# Altium project PCB_Project.PrjPcb
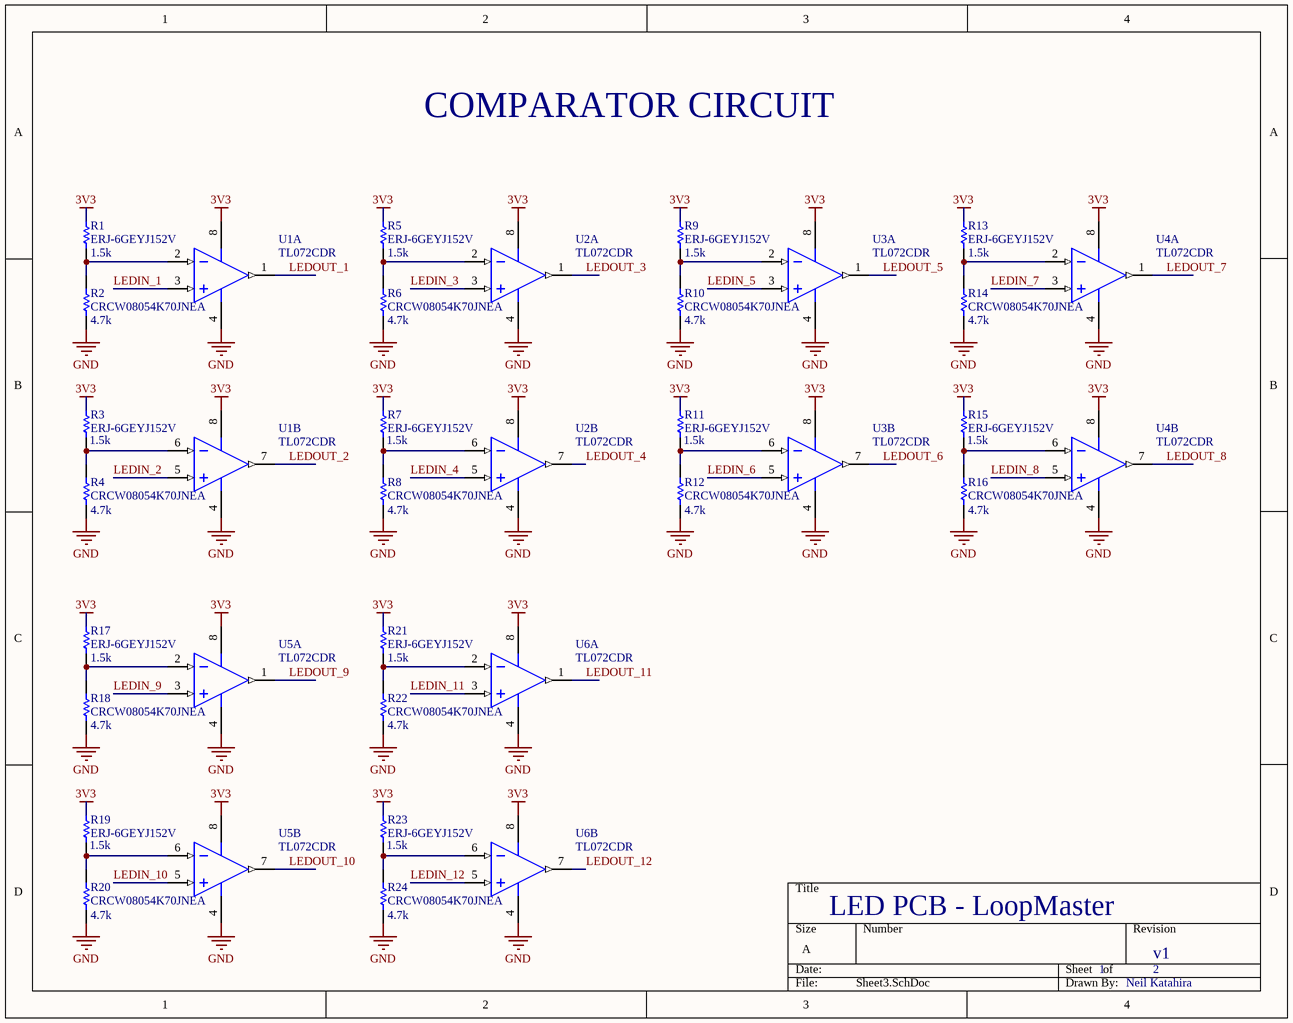
[diagram p0: Sheet3.SchDoc]
1 sheet, 30 parts. Net scope: global (net labels, ports and power ports of the same name join across sheets).
Board file: PCB2.PcbDoc

## Sheet Sheet3.SchDoc
size A

### Parts
R1  ERJ-6GEYJ152V  [RESC2013X70X40NL20T20]
R2  CRCW08054K70JNEA  [RESC2013X50X30LL20T20]
R3  ERJ-6GEYJ152V  [RESC2013X70X40NL20T20]
R4  CRCW08054K70JNEA  [RESC2013X50X30LL20T20]
R5  ERJ-6GEYJ152V  [RESC2013X70X40NL20T20]
R6  CRCW08054K70JNEA  [RESC2013X50X30LL20T20]
R7  ERJ-6GEYJ152V  [RESC2013X70X40NL20T20]
R8  CRCW08054K70JNEA  [RESC2013X50X30LL20T20]
R9  ERJ-6GEYJ152V  [RESC2013X70X40NL20T20]
R10  CRCW08054K70JNEA  [RESC2013X50X30LL20T20]
R11  ERJ-6GEYJ152V  [RESC2013X70X40NL20T20]
R12  CRCW08054K70JNEA  [RESC2013X50X30LL20T20]
R13  ERJ-6GEYJ152V  [RESC2013X70X40NL20T20]
R14  CRCW08054K70JNEA  [RESC2013X50X30LL20T20]
R15  ERJ-6GEYJ152V  [RESC2013X70X40NL20T20]
R16  CRCW08054K70JNEA  [RESC2013X50X30LL20T20]
R17  ERJ-6GEYJ152V  [RESC2013X70X40NL20T20]
R18  CRCW08054K70JNEA  [RESC2013X50X30LL20T20]
R19  ERJ-6GEYJ152V  [RESC2013X70X40NL20T20]
R20  CRCW08054K70JNEA  [RESC2013X50X30LL20T20]
R21  ERJ-6GEYJ152V  [RESC2013X70X40NL20T20]
R22  CRCW08054K70JNEA  [RESC2013X50X30LL20T20]
R23  ERJ-6GEYJ152V  [RESC2013X70X40NL20T20]
R24  CRCW08054K70JNEA  [RESC2013X50X30LL20T20]
U1  TL072CDR  [D0008A_M]  (parts A,B of 2)
U2  TL072CDR  [D0008A_M]  (parts A,B of 2)
U3  TL072CDR  [D0008A_M]  (parts A,B of 2)
U4  TL072CDR  [D0008A_M]  (parts A,B of 2)
U5  TL072CDR  [D0008A_M]  (parts A,B of 2)
U6  TL072CDR  [D0008A_M]  (parts A,B of 2)

### Nets
3V3: R1.2 R3.2 R5.2 R7.2 R9.2 R11.2 R13.2 R15.2 R17.2 R19.2 R21.2 R23.2 U1.8(VCC+) U2.8(VCC+) U3.8(VCC+) U4.8(VCC+) U5.8(VCC+) U6.8(VCC+)
GND: R2.1 R4.1 R6.1 R8.1 R10.1 R12.1 R14.1 R16.1 R18.1 R20.1 R22.1 R24.1 U1.4(VCC-) U2.4(VCC-) U3.4(VCC-) U4.4(VCC-) U5.4(VCC-) U6.4(VCC-)
LEDIN_1: U1.3(IN1+)
LEDIN_2: U1.5(IN2+)
LEDIN_3: U2.3(IN1+)
LEDIN_4: U2.5(IN2+)
LEDIN_5: U3.3(IN1+)
LEDIN_6: U3.5(IN2+)
LEDIN_7: U4.3(IN1+)
LEDIN_8: U4.5(IN2+)
LEDIN_9: U5.3(IN1+)
LEDIN_10: U5.5(IN2+)
LEDIN_11: U6.3(IN1+)
LEDIN_12: U6.5(IN2+)
LEDOUT_1: U1.1(OUT1)
LEDOUT_2: U1.7(OUT2)
LEDOUT_3: U2.1(OUT1)
LEDOUT_4: U2.7(OUT2)
LEDOUT_5: U3.1(OUT1)
LEDOUT_6: U3.7(OUT2)
LEDOUT_7: U4.1(OUT1)
LEDOUT_8: U4.7(OUT2)
LEDOUT_9: U5.1(OUT1)
LEDOUT_10: U5.7(OUT2)
LEDOUT_11: U6.1(OUT1)
LEDOUT_12: U6.7(OUT2)
NetR1_1: R1.1 R2.2 U1.2(IN1-)
NetR3_1: R3.1 R4.2 U1.6(IN2-)
NetR5_1: R5.1 R6.2 U2.2(IN1-)
NetR7_1: R7.1 R8.2 U2.6(IN2-)
NetR9_1: R9.1 R10.2 U3.2(IN1-)
NetR11_1: R11.1 R12.2 U3.6(IN2-)
NetR13_1: R13.1 R14.2 U4.2(IN1-)
NetR15_1: R15.1 R16.2 U4.6(IN2-)
NetR17_1: R17.1 R18.2 U5.2(IN1-)
NetR19_1: R19.1 R20.2 U5.6(IN2-)
NetR21_1: R21.1 R22.2 U6.2(IN1-)
NetR23_1: R23.1 R24.2 U6.6(IN2-)

### Notes on the sheet
- COMPARATOR CIRCUIT
- (near R1) 1.5k
- (near R5) 1.5k
- (near R9) 1.5k
- (near R13) 1.5k
- (near R2) 4.7k
- (near R6) 4.7k
- (near R10) 4.7k
- (near R14) 4.7k
- (near R3) 1.5k
- (near R7) 1.5k
- (near R11) 1.5k
- (near R15) 1.5k
- (near R4) 4.7k
- (near R8) 4.7k
- (near R12) 4.7k
- (near R16) 4.7k
- (near R17) 1.5k
- (near R21) 1.5k
- (near R18) 4.7k
- (near R22) 4.7k
- (near R19) 1.5k
- (near R23) 1.5k
- (near R20) 4.7k
- (near R24) 4.7k
- LED PCB - LoopMaster
- 1
- 2
- v1
- Neil Katahira

### Library data of the parts
R1 R3 R5 R7 R9 R11 R13 R15 R17 R19 R21 R23 = CMP-2001-00355-1: Manufacturer: Panasonic; Part Number: ERJ-6GEYJ152V
R2 R4 R6 R8 R10 R12 R14 R16 R18 R20 R22 R24 = CMP-2001-03967-1: Manufacturer: Vishay Dale; Part Number: CRCW08054K70JNEA
U1-U6 = CMP-0017-00628-2: Dual Low-Noise JFET-Input General-Purpose Operational Amplifier, 7 to 36 V, 0 to 70 degC, 8-pin SOIC (D8), Green (RoHS & no Sb/Br); Manufacturer: Texas Instruments; Total Supply Voltage(Min)(+5V is 5, +/-5V is 10): 7; IIB(Max)(pA): 200; Sub Family: General Purpose Amplifier, High Supply Voltage Amplifier (>=30V); Number of Channels: 2; Iq per channel(Max)(mA): 2.5; Total Supply Voltage(Max)(+5V is 5, +/-5V is 10): 36; Vio (25C)(Max)(mV): 10; Offset Drift(Typ)(uV/C): 18; CMRR(Min)(dB): 70; Rating: Catalog; Slew Rate(Typ)(V/us): 13; GBW(Typ)(MHz): 3; ComponentLink1Description: Manufacturer URL; Code_JEDEC: MS-012; ComponentLink3Description: Package Specification; Mounting Technology: Surface Mount; Eco-Plan: Green (RoHS & no Sb/Br); ComponentLink3URL: http://www.ti.com/litv/pdf/msoi002j; ComponentLink1URL: http://www.ti.com/; PackageVersion: 4040047-3/M, 06/2011; ComponentLink2URL: http://www.ti.com/lit/ds/symlink/tl072.pdf; PartNumber: TL072CDR; PackageDescription: 8-Pin Plastic Small Outline, Body 4.9 x 3.9 mm, Pitch 1.27 mm; DatasheetVersion: SLOS080J; Vn at 1kHz(Typ)(nV/rtHz): 18; ComponentLink2Description: Datasheet; PackageReference: D0008A